# Altium schematic sheet VOLTAGE_MONITOR.SchDoc
size A; SheetNumber: 6; SheetTotal: 7
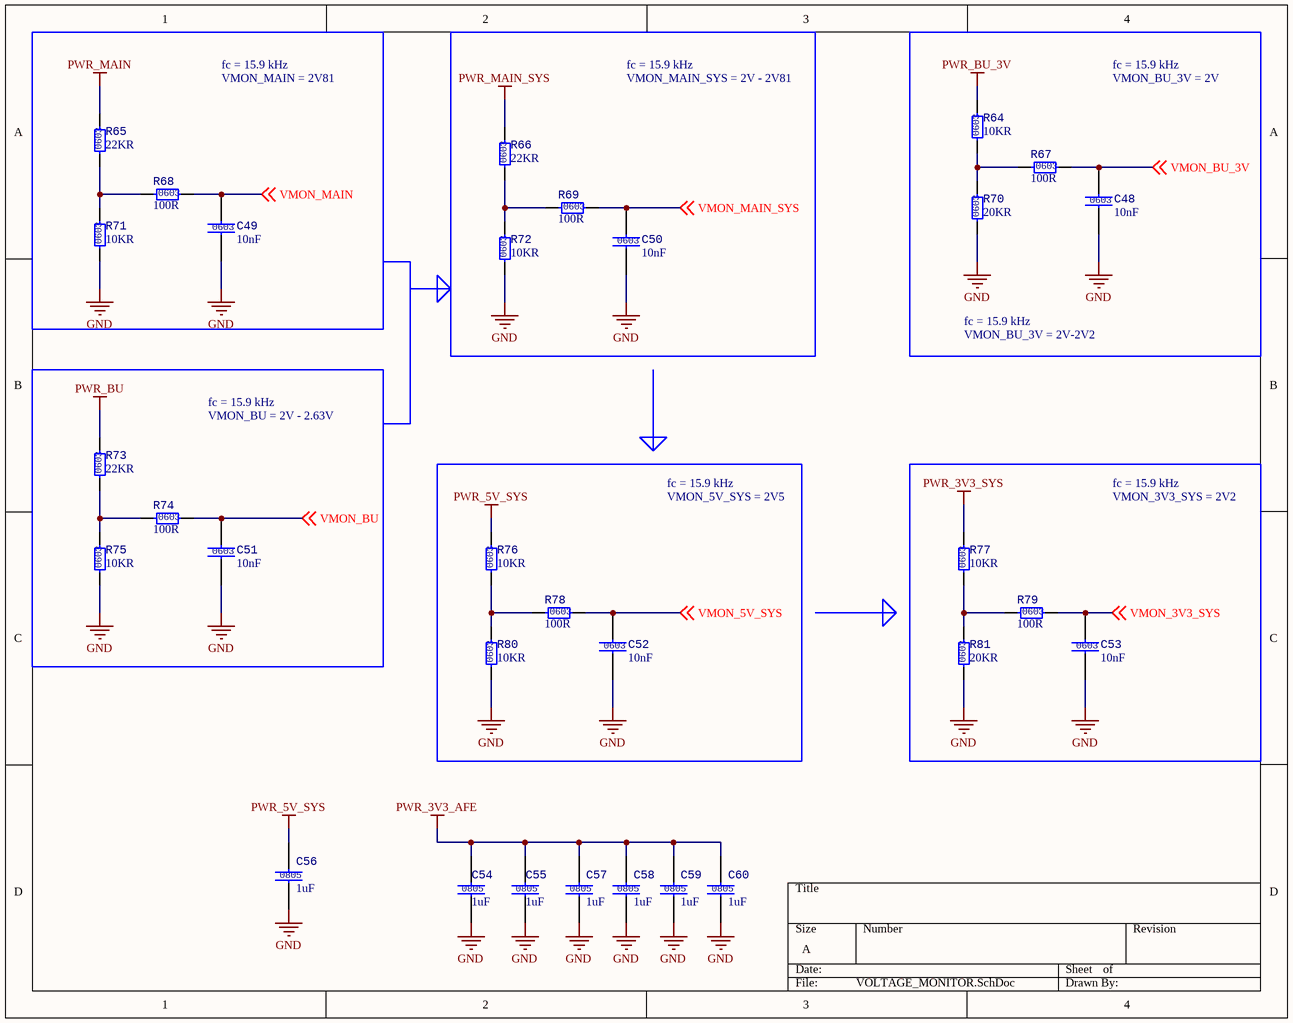
[diagram p0: VOLTAGE_MONITOR.SchDoc]

## Parts
C48  value 10nF  Size: 0603  [CAPCER 0805 SMD]  (hidden comment: Tụ Gốm 0603 10nF 50V)
C49  value 10nF  Size: 0603  [CAPCER 0805 SMD]  (hidden comment: Tụ Gốm 0603 10nF 50V)
C50  value 10nF  Size: 0603  [CAPCER 0805 SMD]  (hidden comment: Tụ Gốm 0603 10nF 50V)
C51  value 10nF  Size: 0603  [CAPCER 0805 SMD]  (hidden comment: Tụ Gốm 0603 10nF 50V)
C52  value 10nF  Size: 0603  [CAPCER 0805 SMD]  (hidden comment: Tụ Gốm 0603 10nF 50V)
C53  value 10nF  Size: 0603  [CAPCER 0805 SMD]  (hidden comment: Tụ Gốm 0603 10nF 50V)
C54  Size: 0805  [CAPCER 0805 SMD]  (hidden comment: 1uF)
C55  Size: 0805  [CAPCER 0805 SMD]  (hidden comment: 1uF)
C56  Size: 0805  [CAPCER 0805 SMD]  (hidden comment: 1uF)
C57  Size: 0805  [CAPCER 0805 SMD]  (hidden comment: 1uF)
C58  value 1uF  Size: 0805  [CAPCER 0603 SMD]  (hidden comment: 10uF)
C59  Size: 0805  [CAPCER 0805 SMD]  (hidden comment: 1uF)
C60  value 1uF  Size: 0805  [CAPCER 0603 SMD]  (hidden comment: 10uF)
R64  Size: 0603  [RESC 0603(1608) SMD]  (hidden comment: 10KR)
R65  Size: 0603  [RESC 0603(1608) SMD]  (hidden comment: 22KR)
R66  Size: 0603  [RESC 0603(1608) SMD]  (hidden comment: 22KR)
R67  Size: 0603  [RESC 0603(1608) SMD]  (hidden comment: 100R)
R68  Size: 0603  [RESC 0603(1608) SMD]  (hidden comment: 100R)
R69  Size: 0603  [RESC 0603(1608) SMD]  (hidden comment: 100R)
R70  Size: 0603  [RESC 0603(1608) SMD]  (hidden comment: 20KR)
R71  Size: 0603  [RESC 0603(1608) SMD]  (hidden comment: 10KR)
R72  Size: 0603  [RESC 0603(1608) SMD]  (hidden comment: 10KR)
R73  Size: 0603  [RESC 0603(1608) SMD]  (hidden comment: 22KR)
R74  Size: 0603  [RESC 0603(1608) SMD]  (hidden comment: 100R)
R75  Size: 0603  [RESC 0603(1608) SMD]  (hidden comment: 10KR)
R76  Size: 0603  [RESC 0603(1608) SMD]  (hidden comment: 10KR)
R77  Size: 0603  [RESC 0603(1608) SMD]  (hidden comment: 10KR)
R78  Size: 0603  [RESC 0603(1608) SMD]  (hidden comment: 100R)
R79  Size: 0603  [RESC 0603(1608) SMD]  (hidden comment: 100R)
R80  Size: 0603  [RESC 0603(1608) SMD]  (hidden comment: 10KR)
R81  Size: 0603  [RESC 0603(1608) SMD]  (hidden comment: 20KR)

## Nets
GND: C48.2 C49.2 C50.2 C51.2 C52.2 C53.2 C54.2 C55.2 C56.2 C57.2 C58.2 C59.2 C60.2 R70.1 R71.1 R72.1 R75.1 R80.1 R81.1
PWR_3V3_AFE: C54.1 C55.1 C57.1 C58.1 C59.1 C60.1
PWR_3V3_SYS: R77.2
PWR_5V_SYS: C56.1 R76.2
PWR_BU: R73.2
PWR_BU_3V: R64.2
PWR_MAIN: R65.2
PWR_MAIN_SYS: R66.2
VMON_3V3_SYS: C53.1 R79.2 ; off-sheet VMON_3V3_SYS
VMON_5V_SYS: C52.1 R78.2 ; off-sheet VMON_5V_SYS
VMON_BU: C51.1 R74.2 ; off-sheet VMON_BU
VMON_BU_3V: C48.1 R67.2 ; off-sheet VMON_BU_3V
VMON_MAIN: C49.1 R68.2 ; off-sheet VMON_MAIN
VMON_MAIN_SYS: C50.1 R69.2 ; off-sheet VMON_MAIN_SYS
NetR64_1: R64.1 R67.1 R70.2
NetR65_1: R65.1 R68.1 R71.2
NetR66_1: R66.1 R69.1 R72.2
NetR73_1: R73.1 R74.1 R75.2
NetR76_1: R76.1 R78.1 R80.2
NetR77_1: R77.1 R79.1 R81.2

## Notes on the sheet
- fc = 15.9 kHz
- VMON_MAIN = 2V81
- VMON_MAIN_SYS = 2V - 2V81
- VMON_BU_3V = 2V
- VMON_BU_3V = 2V-2V2
- VMON_BU = 2V - 2.63V
- VMON_5V_SYS = 2V5
- VMON_3V3_SYS = 2V2

## Library data of the parts
C48-C53 = DB-0079: CAPACITOR SMD 0.01uF 50V 10% 0603; Design Item ID: DB-0079; Type: CAPACITOR; Power Rate: N/A; Tolerance: 10%; Footprint Type: SMD; Supplier: THEGIOIIC; Supplier Part Number: Tụ Gốm 0603 10nF 50V; Supplier Link: https://www.thegioiic.com/tu-gom-0603-100nf-0-1uf-25v
C54-C60 = DB-0063: CAPACITOR SMD 1uF 16V 10% 0805; Design Item ID: DB-0063; Type: CAPACITOR; Power Rate: N/A; Tolerance: 10%; Footprint Type: SMD; Supplier: THEGIOIIC; Supplier Part Number: Tụ Gốm 0805 1uF 16V; Supplier Link: https://www.thegioiic.com/tu-gom-0805-1uf-16v
  C54-C57 C59: Value: 1uF
R64 R71 R72 R75-R77 R80 = DB-0003: RESISTOR SMD 10KR OHM 1% 100mW 0603; Power Rate: 100mW; Design Item ID: DB-0003; Value: 10KR; Type: RESISTOR; Tolerance: 1%; Footprint Type: SMD; Supplier: THEGIOIIC; Supplier Part Number: Điện Trở 10 KOhm 0603 1%; Supplier Link: https://www.thegioiic.com/dien-tro-10-kohm-0603-1-
R65 R66 R73 = DB-0030: Điện Trở 22 KOhm 0603 1%; Power Rate: *; Design Item ID: DB-0030; Value: 22KR; Type: RESISTOR; Footprint Type: SMD; Supplier: THEGIOIIC; Supplier Link: https://www.thegioiic.com/dien-tro-22-kohm-0603-1-
R67-R69 R74 R78 R79 = DB-0032: Điện Trở 100 Ohm 0603 1%; Power Rate: *; Design Item ID: DB-0032; Value: 100R; Type: RESISTOR; Footprint Type: SMD; Supplier: THEGIOIIC; Supplier Link: https://www.thegioiic.com/dien-tro-100-ohm-0603-1-
R70 R81 = DB-0031: Điện Trở 20 KOhm 0603 1%; Power Rate: *; Design Item ID: DB-0031; Value: 20KR; Type: RESISTOR; Footprint Type: SMD; Supplier: THEGIOIIC; Supplier Link: https://www.thegioiic.com/dien-tro-20-kohm-0603-1-